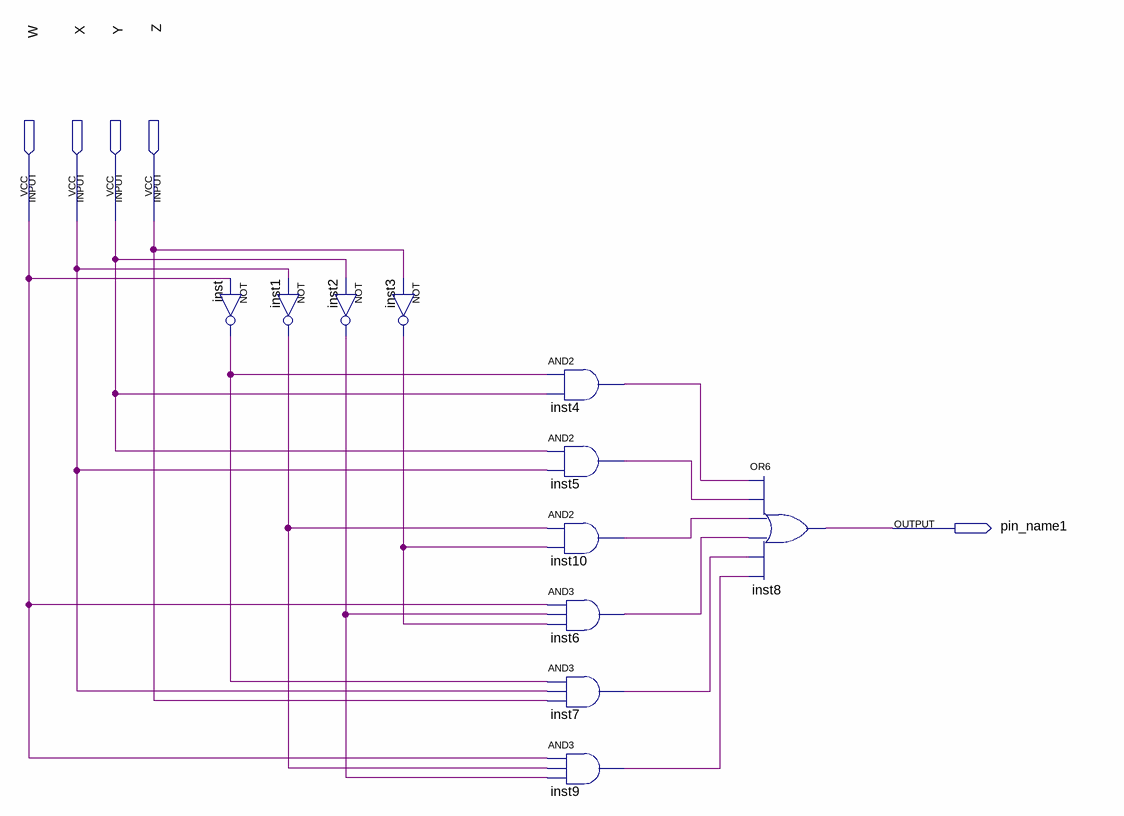
[diagram p0: schematic sheet]
// Quartus schematic SegA_Backup.bdf as structural Verilog: 11 symbols, 5 pins
module SegA_Backup (
  input  W,
  input  X,
  input  Y,
  input  Z,
  output pin_name1
);

  wire inst1_out, inst2_out, inst3_out, inst4_out, inst5_out, inst6_out, inst7_out, inst9_out, inst10_out,
       inst_out;

  not inst (inst_out, W);
  not inst1 (inst1_out, X);
  not inst2 (inst2_out, Y);
  not inst3 (inst3_out, Z);
  and inst4 (inst4_out, inst_out, Y);
  and inst5 (inst5_out, Y, X);
  and inst10 (inst10_out, inst1_out, inst3_out);
  and inst6 (inst6_out, W, inst2_out, inst3_out);
  and inst7 (inst7_out, inst_out, X, Z);
  and inst9 (inst9_out, W, inst1_out, inst2_out);
  or inst8 (pin_name1, inst4_out, inst5_out, inst10_out, inst6_out, inst7_out, inst9_out);
endmodule
